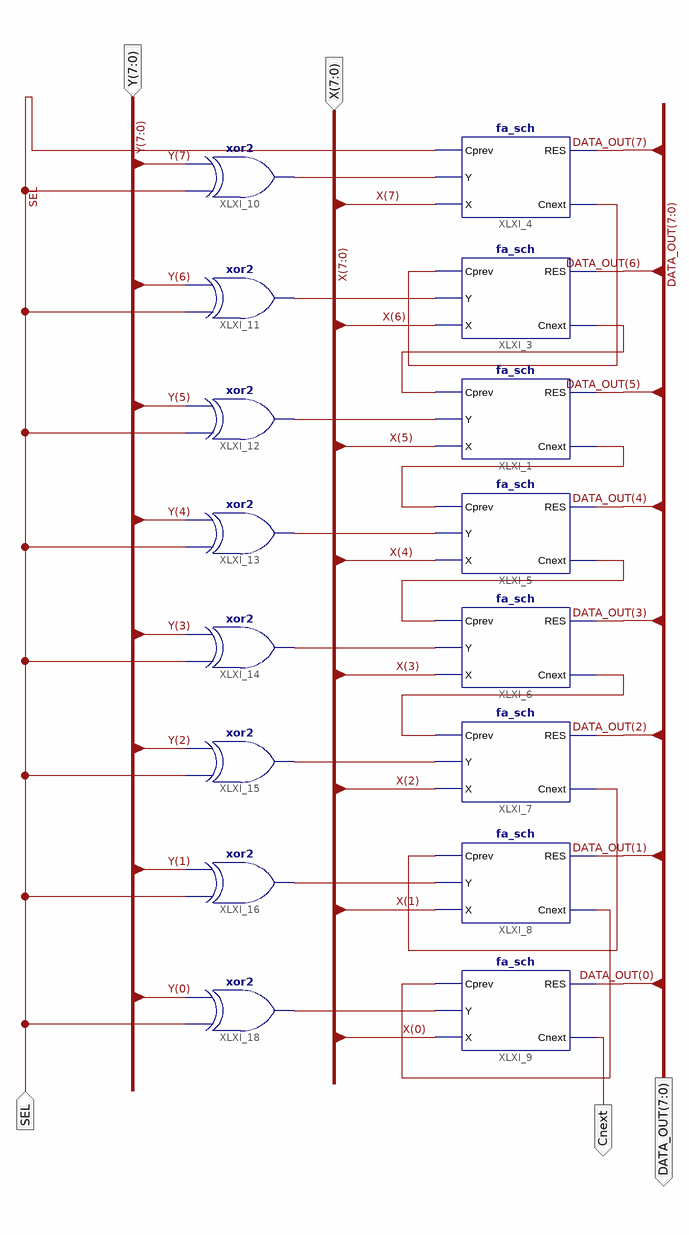
[diagram p0: schematic sheet 1]
// Xilinx ISE schematic alu_sch.sch (spartan3e) as structural Verilog: 16 symbols, 5 ports
module alu_sch (
  input  [7:0] X,
  input  [7:0] Y,
  input  SEL,
  output [7:0] DATA_OUT,
  output Cnext
);

  wire XLXN_32, XLXN_33, XLXN_34, XLXN_35, XLXN_36, XLXN_37, XLXN_38, XLXN_57, XLXN_58, XLXN_59, XLXN_60,
       XLXN_61, XLXN_62, XLXN_63, XLXN_64;

  fa_sch XLXI_1 (.Cprev(XLXN_33), .Y(XLXN_59), .X(X[5]), .RES(DATA_OUT[5]), .Cnext(XLXN_34));
  fa_sch XLXI_3 (.Cprev(XLXN_32), .Y(XLXN_58), .X(X[6]), .RES(DATA_OUT[6]), .Cnext(XLXN_33));
  fa_sch XLXI_4 (.Cprev(SEL), .Y(XLXN_57), .X(X[7]), .RES(DATA_OUT[7]), .Cnext(XLXN_32));
  fa_sch XLXI_5 (.Cprev(XLXN_34), .Y(XLXN_60), .X(X[4]), .RES(DATA_OUT[4]), .Cnext(XLXN_35));
  fa_sch XLXI_6 (.Cprev(XLXN_35), .Y(XLXN_61), .X(X[3]), .RES(DATA_OUT[3]), .Cnext(XLXN_36));
  fa_sch XLXI_7 (.Cprev(XLXN_36), .Y(XLXN_62), .X(X[2]), .RES(DATA_OUT[2]), .Cnext(XLXN_37));
  fa_sch XLXI_8 (.Cprev(XLXN_37), .Y(XLXN_63), .X(X[1]), .RES(DATA_OUT[1]), .Cnext(XLXN_38));
  fa_sch XLXI_9 (.Cprev(XLXN_38), .Y(XLXN_64), .X(X[0]), .RES(DATA_OUT[0]), .Cnext(Cnext));
  xor XLXI_10 (XLXN_57, SEL, Y[7]);
  xor XLXI_11 (XLXN_58, SEL, Y[6]);
  xor XLXI_12 (XLXN_59, SEL, Y[5]);
  xor XLXI_13 (XLXN_60, SEL, Y[4]);
  xor XLXI_14 (XLXN_61, SEL, Y[3]);
  xor XLXI_15 (XLXN_62, SEL, Y[2]);
  xor XLXI_16 (XLXN_63, SEL, Y[1]);
  xor XLXI_18 (XLXN_64, SEL, Y[0]);
endmodule
